# Altium schematic sheet power_supply.SchDoc
size A4
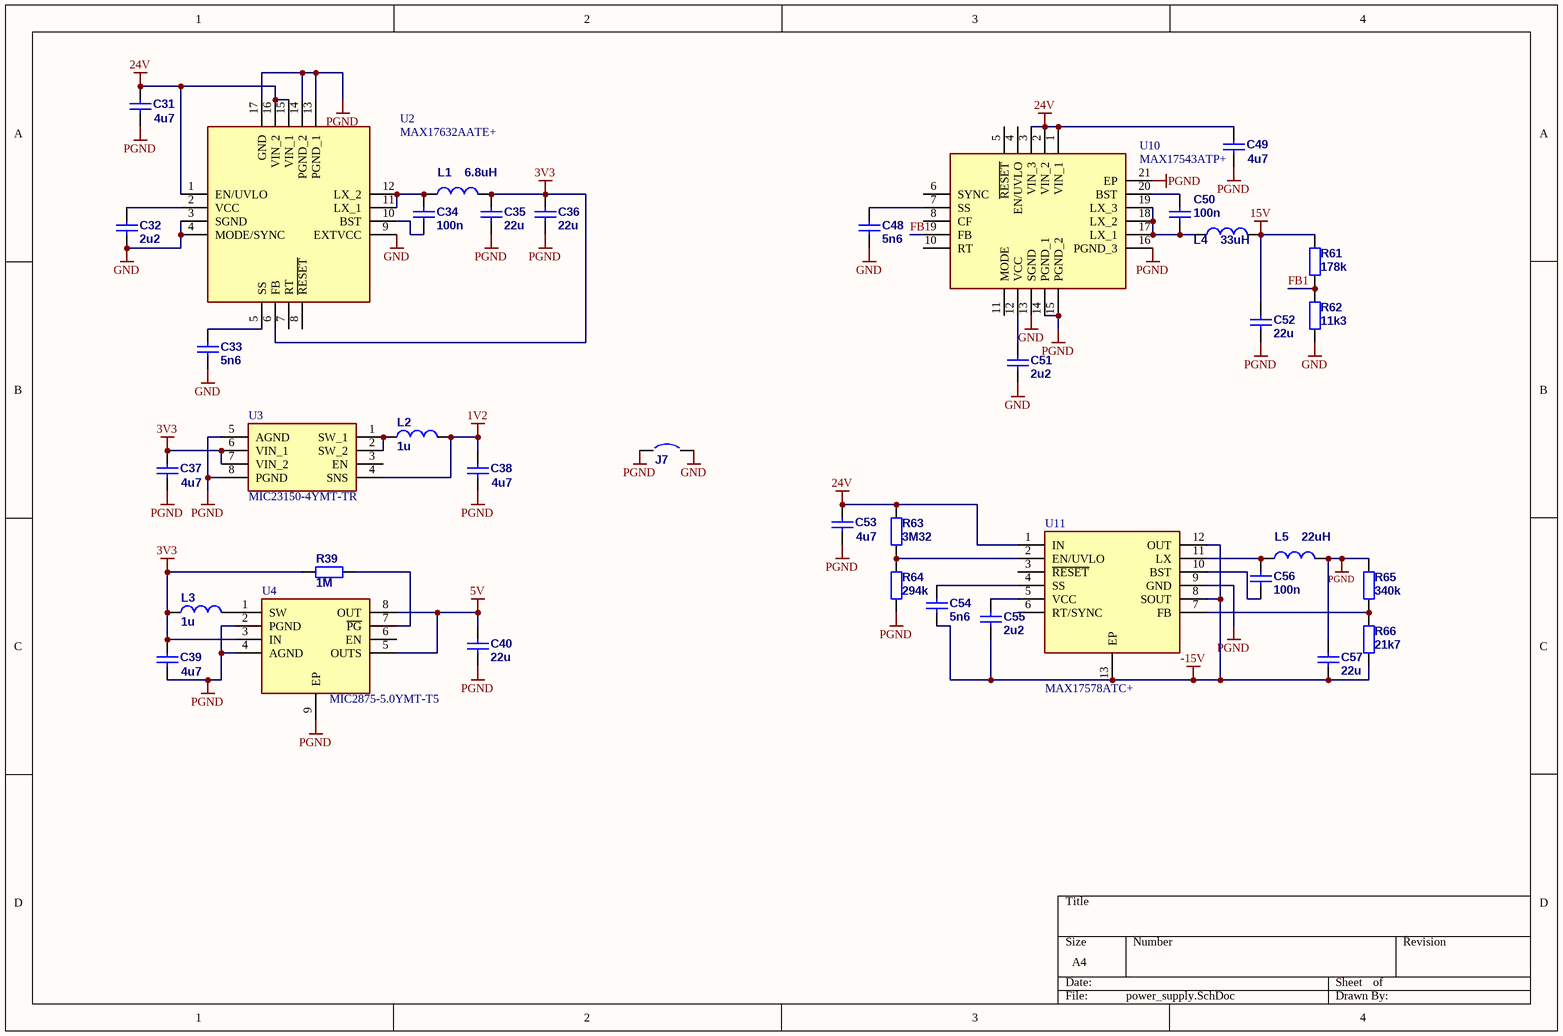
[diagram p0: power_supply.SchDoc]

## Parts
C31  4u7  [C1206]
C32  2u2  [C0603]
C33  5n6  [C0603]
C34  100n  [C0603]
C35  22u  [C1206]
C36  22u  [C1206]
C37  4u7  [C1206]
C38  4u7  [C1206]
C39  4u7  [C1206]
C40  22u  [C1206]
C48  5n6  [C0603]
C49  4u7  [C1206]
C50  100n  [C0603]
C51  2u2  [C0603]
C52  22u  [C1206]
C53  4u7  [C1206]
C54  5n6  [C0603]
C55  2u2  [C0603]
C56  100n  [C0603]
C57  22u  [C1206]
J7  Circuit Breaker  [JMP2_0805_N_NC]  (value not drawn)
L1  6.8uH  [DE1205]
L2  1u  [L1210]
L3  1u  [L1210]
L4  33uH  [DE1205]
L5  22uH  [DE1205]
R39  1M  [R0603]
R61  178k  [R0603]
R62  11k3  [R0603]
R63  3M32  [R0603]
R64  294k  [R0603]
R65  340k  [R0603]
R66  21k7  [R0603]
U2  MAX17632AATE+  [QFN50P300X300X80-17N]
U3  MIC23150-4YMT-TR  [MIC231504YMTTR]
U4  MIC2875-5.0YMT-T5  [SON50P200X200X60-9N-D]
U10  MAX17543ATP+  [QFN50P400X400X80-21N]
U11  MAX17578ATC+  [SON50P300X300X80-13N]

## Nets
1V2: C38.2 L2.2 U3.4(SNS)
3V3: C35.2 C36.2 C37.2 C39.2 L1.2 L3.1 R39.1 U2.6(FB) U3.6(VIN_1) U3.7(VIN_2) U4.3(IN)
5V: C40.2 U4.5(OUTS) U4.8(OUT)
15V: C52.2 L4.2 R61.2
24V: C31.2 C49.2 C53.2 R63.2 U2.1(EN/UVLO) U2.15(VIN_1) U2.16(VIN_2) U10.1(VIN_1) U10.2(VIN_2) U10.3(VIN_3) U11.1(IN)
-15V: C54.1 C55.1 C57.1 R66.1 U11.8(SOUT) U11.12(OUT) U11.13(EP)
GND: C32.1 C33.1 C48.1 C51.1 J7.2 R62.1 U2.3(SGND) U2.4(MODE/SYNC) U2.9(EXTVCC) U10.13(SGND)
PGND: C31.1 C35.1 C36.1 C37.1 C38.1 C39.1 C40.1 C49.1 C52.1 C53.1 C57.2 J7.1 L5.2 R64.1 R65.2 U2.13(PGND_1) U2.14(PGND_2) U2.17(GND) U3.5(AGND) U3.8(PGND) U4.2(PGND) U4.4(AGND) U4.9(EP) U10.14(PGND_1) U10.15(PGND_2) U10.16(PGND_3) U10.21(EP) U11.9(GND)
FB1: R61.1 R62.2 U10.9(FB)
NetC32_2: C32.2 U2.2(VCC)
NetC33_2: C33.2 U2.5(SS)
NetC34_1: C34.1 L1.1 U2.11(LX_1) U2.12(LX_2)
NetC34_2: C34.2 U2.10(BST)
NetC48_2: C48.2 U10.7(SS)
NetC50_1: C50.1 L4.1 U10.17(LX_1) U10.18(LX_2) U10.19(LX_3)
NetC50_2: C50.2 U10.20(BST)
NetC51_2: C51.2 U10.12(VCC)
NetC54_2: C54.2 U11.4(SS)
NetC55_2: C55.2 U11.5(VCC)
NetC56_1: C56.1 L5.1 U11.11(LX)
NetC56_2: C56.2 U11.10(BST)
NetL2_1: L2.1 U3.1(SW_1) U3.2(SW_2)
NetL3_2: L3.2 U4.1(SW)
NetR39_2: R39.2 U4.7(~{PG})
NetR63_1: R63.1 R64.2 U11.2(EN/UVLO)
NetR65_1: R65.1 R66.2 U11.7(FB)

Not connected (* = marked no-connect by the designer): U2 7(RT) 8(~{RESET}); U3 3(EN); U4 6(EN); U10 4(EN/UVLO) 5(~{RESET}) 6(SYNC) 8(CF) 10(RT) 11(MODE); U11 3(~{RESET}) 6(RT/SYNC)

## Library data of the parts
C31-C40 C48-C57 = Cap: Capacitor; ComponentLink1Description: datasheet; ComponentLink2Description: supplier
  C31 C37-C39 C49 C53: Value: 4u7
  C32 C51 C55: Value: 2u2
  C33 C48 C54: Value: 5n6
  C34 C50 C56: Value: 100n
  C35 C36 C40 C52 C57: Value: 22u
J7 = Circuit Breaker: Solder: NO; Published: 24-Mar-1999; Revision: July-2002: Re-released for DXP Platform.; Publisher: Altium Limited
L1 = DE1205-10: Published: 08-Mar-2006; ComponentLink1Description: datasheet; ComponentLink2Description: supplier; Supplier 1: TME; Supplier Part Number 1: DE1205-10; Value: 6.8uH
L2 L3 = Ind: Inductor; Published: 08-Mar-2006; ComponentLink1Description: datasheet; ComponentLink2Description: supplier; value: 1u
L4 L5 = DE1205-22: Published: 08-Mar-2006; ComponentLink1Description: datasheet; ComponentLink2Description: supplier; Supplier 1: TME; Supplier Part Number 1: DE1205-22
  L4: Value: 33uH
  L5: Value: 22uH
R39 R61-R66 = Res: Resistor; Published: 19-Feb-2006; ComponentLink1Description: datasheet; ComponentLink2Description: supplier
  R39: Value: 1M
  R61: Value: 178k
  R62: Value: 11k3
  R63: Value: 3M32
  R64: Value: 294k
  R65: Value: 340k
  R66: Value: 21k7
U2 = MAX17632AATE+: Integrated Circuit; Manufacturer_Name: Maxim Integrated; Datasheet Link: https://datasheets.maximintegrated.com/en/ds/MAX17632.pdf; Height: 0.8mm; Manufacturer_Part_Number: MAX17632AATE+
U3 = MIC23150-4YMT-TR: Integrated Circuit; Manufacturer_Name: Microchip; Datasheet Link: https://ww1.microchip.com/downloads/en/DeviceDoc/mic23150.pdf; Height: 0.6mm; Manufacturer_Part_Number: MIC23150-4YMT-TR; Mouser Part Number: 998-MIC23150-4YMTTR; Mouser Price/Stock: https://www.mouser.co.uk/ProductDetail/Microchip-Technology-Micrel/MIC23150-4YMT-TR?qs=Y3Q3JoKAO1Sp7WXfkXLXrw%3D%3D; Arrow Part Number: MIC23150-4YMT-TR; Arrow Price/Stock: https://www.arrow.com/en/products/mic23150-4ymt-tr/microchip-technology?region=nac
U4 = MIC2875-5.0YMT-T5: Integrated Circuit; Manufacturer_Name: Microchip; Datasheet Link: http://ww1.microchip.com/downloads/en/DeviceDoc/20005549A.pdf; Height: 0.6mm; Manufacturer_Part_Number: MIC2875-5.0YMT-T5
U10 = MAX17543ATP+: Integrated Circuit; Manufacturer_Name: Maxim Integrated; Datasheet Link: https://pdfserv.maximintegrated.com/en/ds/MAX17543.pdf; Height: 0.8mm; Manufacturer_Part_Number: MAX17543ATP+
U11 = MAX17578ATC+: Integrated Circuit; Manufacturer_Name: Maxim Integrated; Datasheet Link: https://datasheets.maximintegrated.com/en/ds/MAX17577-MAX17578.pdf; Height: 0.8mm; Manufacturer_Part_Number: MAX17578ATC+